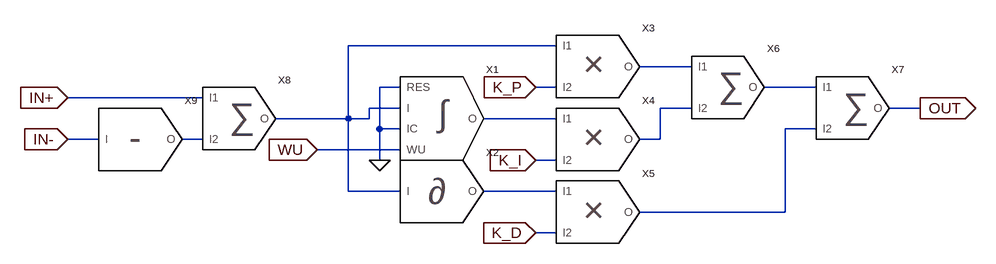
[diagram p0: schematic PID_WU_Diff.asc]
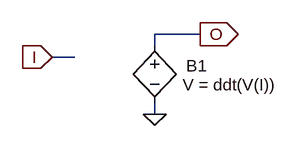
[diagram p1: sub-circuit derivator_module.asc]
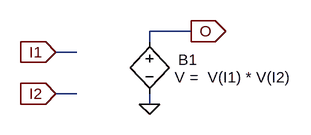
[diagram p2: sub-circuit multiplier_module.asc]
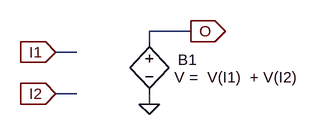
[diagram p3: sub-circuit sum_module.asc]
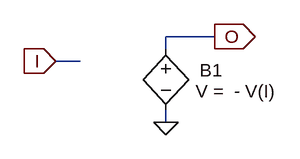
[diagram p4: sub-circuit neg_module.asc]
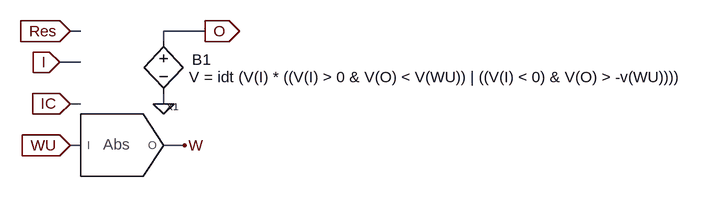
[diagram p5: sub-circuit integrator_wu_module.asc]
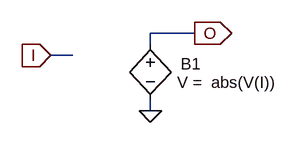
[diagram p6: sub-circuit abs_module.asc]
PID_WU_Diff.asc, the LTspice schematic file:
Version 4
SHEET 1 2148 680
WIRE 1312 112 992 112
WIRE 1520 144 1440 144
WIRE 1072 176 1040 176
WIRE 1312 176 1280 176
WIRE 1712 176 1632 176
WIRE 768 192 560 192
WIRE 1072 208 1024 208
WIRE 1520 208 1472 208
WIRE 1872 208 1824 208
WIRE 992 224 992 112
WIRE 992 224 880 224
WIRE 1024 224 1024 208
WIRE 1024 224 992 224
WIRE 1312 224 1200 224
WIRE 1040 240 1040 176
WIRE 1072 240 1040 240
WIRE 1712 240 1664 240
WIRE 608 256 560 256
WIRE 768 256 736 256
WIRE 1472 256 1472 208
WIRE 1472 256 1440 256
WIRE 1072 272 944 272
WIRE 1040 288 1040 240
WIRE 1312 288 1280 288
WIRE 992 336 992 224
WIRE 1072 336 992 336
WIRE 1312 336 1200 336
WIRE 1664 368 1664 240
WIRE 1664 368 1440 368
WIRE 1312 400 1280 400
FLAG 1872 208 OUT
IOPIN 1872 208 Out
FLAG 1280 176 K_P
IOPIN 1280 176 In
FLAG 1280 288 K_I
IOPIN 1280 288 In
FLAG 1280 400 K_D
IOPIN 1280 400 In
FLAG 1040 288 0
FLAG 560 192 IN+
IOPIN 560 192 In
FLAG 560 256 IN-
IOPIN 560 256 In
FLAG 944 272 WU
IOPIN 944 272 In
SYMBOL derivator_module 1168 320 R0
SYMATTR InstName X2
SYMATTR SpiceLine k=0
SYMBOL multiplier_module 1408 128 R0
SYMATTR InstName X3
SYMBOL multiplier_module 1408 240 R0
SYMATTR InstName X4
SYMBOL multiplier_module 1408 352 R0
SYMATTR InstName X5
SYMBOL sum_module 1600 160 R0
SYMATTR InstName X6
SYMBOL sum_module 1792 192 R0
SYMATTR InstName X7
SYMBOL sum_module 848 208 R0
SYMATTR InstName X8
SYMBOL neg_module 704 240 R0
SYMATTR InstName X9
SYMBOL integrator_WU_module 1216 192 R0
SYMATTR InstName X1

derivator_module.asc, the sub-circuit schematic file:
Version 4
SHEET 1 880 680
WIRE 240 160 176 160
WIRE 176 176 176 160
WIRE 64 192 32 192
WIRE 176 272 176 256
FLAG 32 192 I
IOPIN 32 192 In
FLAG 176 272 0
FLAG 240 160 O
IOPIN 240 160 Out
SYMBOL bv 176 160 R0
WINDOW 0 44 44 Left 0
WINDOW 3 39 71 Left 0
SYMATTR InstName B1
SYMATTR Value V = ddt(V(I))

multiplier_module.asc, the sub-circuit schematic file:
Version 4
SHEET 1 880 680
WIRE 240 160 176 160
WIRE 176 176 176 160
WIRE 64 192 32 192
WIRE 64 256 32 256
WIRE 176 272 176 256
FLAG 32 192 I1
IOPIN 32 192 In
FLAG 32 256 I2
IOPIN 32 256 In
FLAG 176 272 0
FLAG 240 160 O
IOPIN 240 160 Out
SYMBOL bv 176 160 R0
WINDOW 0 44 44 Left 0
WINDOW 3 39 71 Left 0
SYMATTR InstName B1
SYMATTR Value V =  V(I1) * V(I2)

sum_module.asc, the sub-circuit schematic file:
Version 4
SHEET 1 880 680
WIRE 240 160 176 160
WIRE 176 176 176 160
WIRE 64 192 32 192
WIRE 64 256 32 256
WIRE 176 272 176 256
FLAG 32 192 I1
IOPIN 32 192 In
FLAG 32 256 I2
IOPIN 32 256 In
FLAG 176 272 0
FLAG 240 160 O
IOPIN 240 160 Out
SYMBOL bv 176 160 R0
WINDOW 0 44 44 Left 0
WINDOW 3 39 71 Left 0
SYMATTR InstName B1
SYMATTR Value V =  V(I1)  + V(I2)

neg_module.asc, the sub-circuit schematic file:
Version 4
SHEET 1 880 680
WIRE 240 160 176 160
WIRE 176 176 176 160
WIRE 64 192 32 192
WIRE 176 272 176 256
FLAG 32 192 I
IOPIN 32 192 In
FLAG 176 272 0
FLAG 240 160 O
IOPIN 240 160 Out
SYMBOL bv 176 160 R0
WINDOW 0 44 44 Left 0
WINDOW 3 39 71 Left 0
SYMATTR InstName B1
SYMATTR Value V =  - V(I)

integrator_wu_module.asc, the sub-circuit schematic file:
Version 4
SHEET 1 880 680
WIRE 128 160 112 160
WIRE 320 160 256 160
WIRE 256 176 256 160
WIRE 128 208 96 208
WIRE 128 272 112 272
WIRE 256 272 256 256
WIRE 128 336 112 336
WIRE 288 336 256 336
FLAG 96 208 I
IOPIN 96 208 In
FLAG 256 272 0
FLAG 320 160 O
IOPIN 320 160 Out
FLAG 112 272 IC
IOPIN 112 272 In
FLAG 112 160 Res
IOPIN 112 160 In
FLAG 112 336 WU
IOPIN 112 336 In
FLAG 288 336 W
SYMBOL bv 256 160 R0
WINDOW 0 44 44 Left 0
WINDOW 3 39 71 Left 0
SYMATTR InstName B1
SYMATTR Value V = idt (V(I) * ((V(I) > 0 & V(O) < V(WU)) | ((V(I) < 0) & V(O) > -v(WU))))
SYMBOL abs_module 224 320 R0
SYMATTR InstName X1

abs_module.asc, the sub-circuit schematic file:
Version 4
SHEET 1 880 680
WIRE 240 160 176 160
WIRE 176 176 176 160
WIRE 64 192 32 192
WIRE 176 272 176 256
FLAG 32 192 I
IOPIN 32 192 In
FLAG 176 272 0
FLAG 240 160 O
IOPIN 240 160 Out
SYMBOL bv 176 160 R0
WINDOW 0 44 44 Left 0
WINDOW 3 39 71 Left 0
SYMATTR InstName B1
SYMATTR Value V =  abs(V(I))

The netlist it stands for:
* PID_WU_Diff.asc
XX2 N008 N001 derivator_module params: k=0
XX3 N002 N001 K_P multiplier_module
XX4 N004 N005 K_I multiplier_module
XX5 N006 N008 K_D multiplier_module
XX6 N003 N002 N004 sum_module
XX7 OUT N003 N006 sum_module
XX8 N001 IN+ N007 sum_module
XX9 N007 IN- neg_module
XX1 N005 N001 0 0 WU integrator_wu_module

* block symbol definitions
.subckt derivator_module O I
B1 O 0 V = ddt(V(I))
.ends derivator_module

.subckt multiplier_module O I1 I2
B1 O 0 V =  V(I1) * V(I2)
.ends multiplier_module

.subckt sum_module O I1 I2
B1 O 0 V =  V(I1)  + V(I2)
.ends sum_module

.subckt neg_module O I
B1 O 0 V =  - V(I)
.ends neg_module

.subckt integrator_wu_module O I IC RES WU
B1 O 0 V = idt (V(I) * ((V(I) > 0 & V(O) < V(WU)) | ((V(I) < 0) & V(O) > -v(WU))))
XX1 W WU abs_module
.ends integrator_wu_module

.subckt abs_module O I
B1 O 0 V =  abs(V(I))
.ends abs_module

.backanno
.end